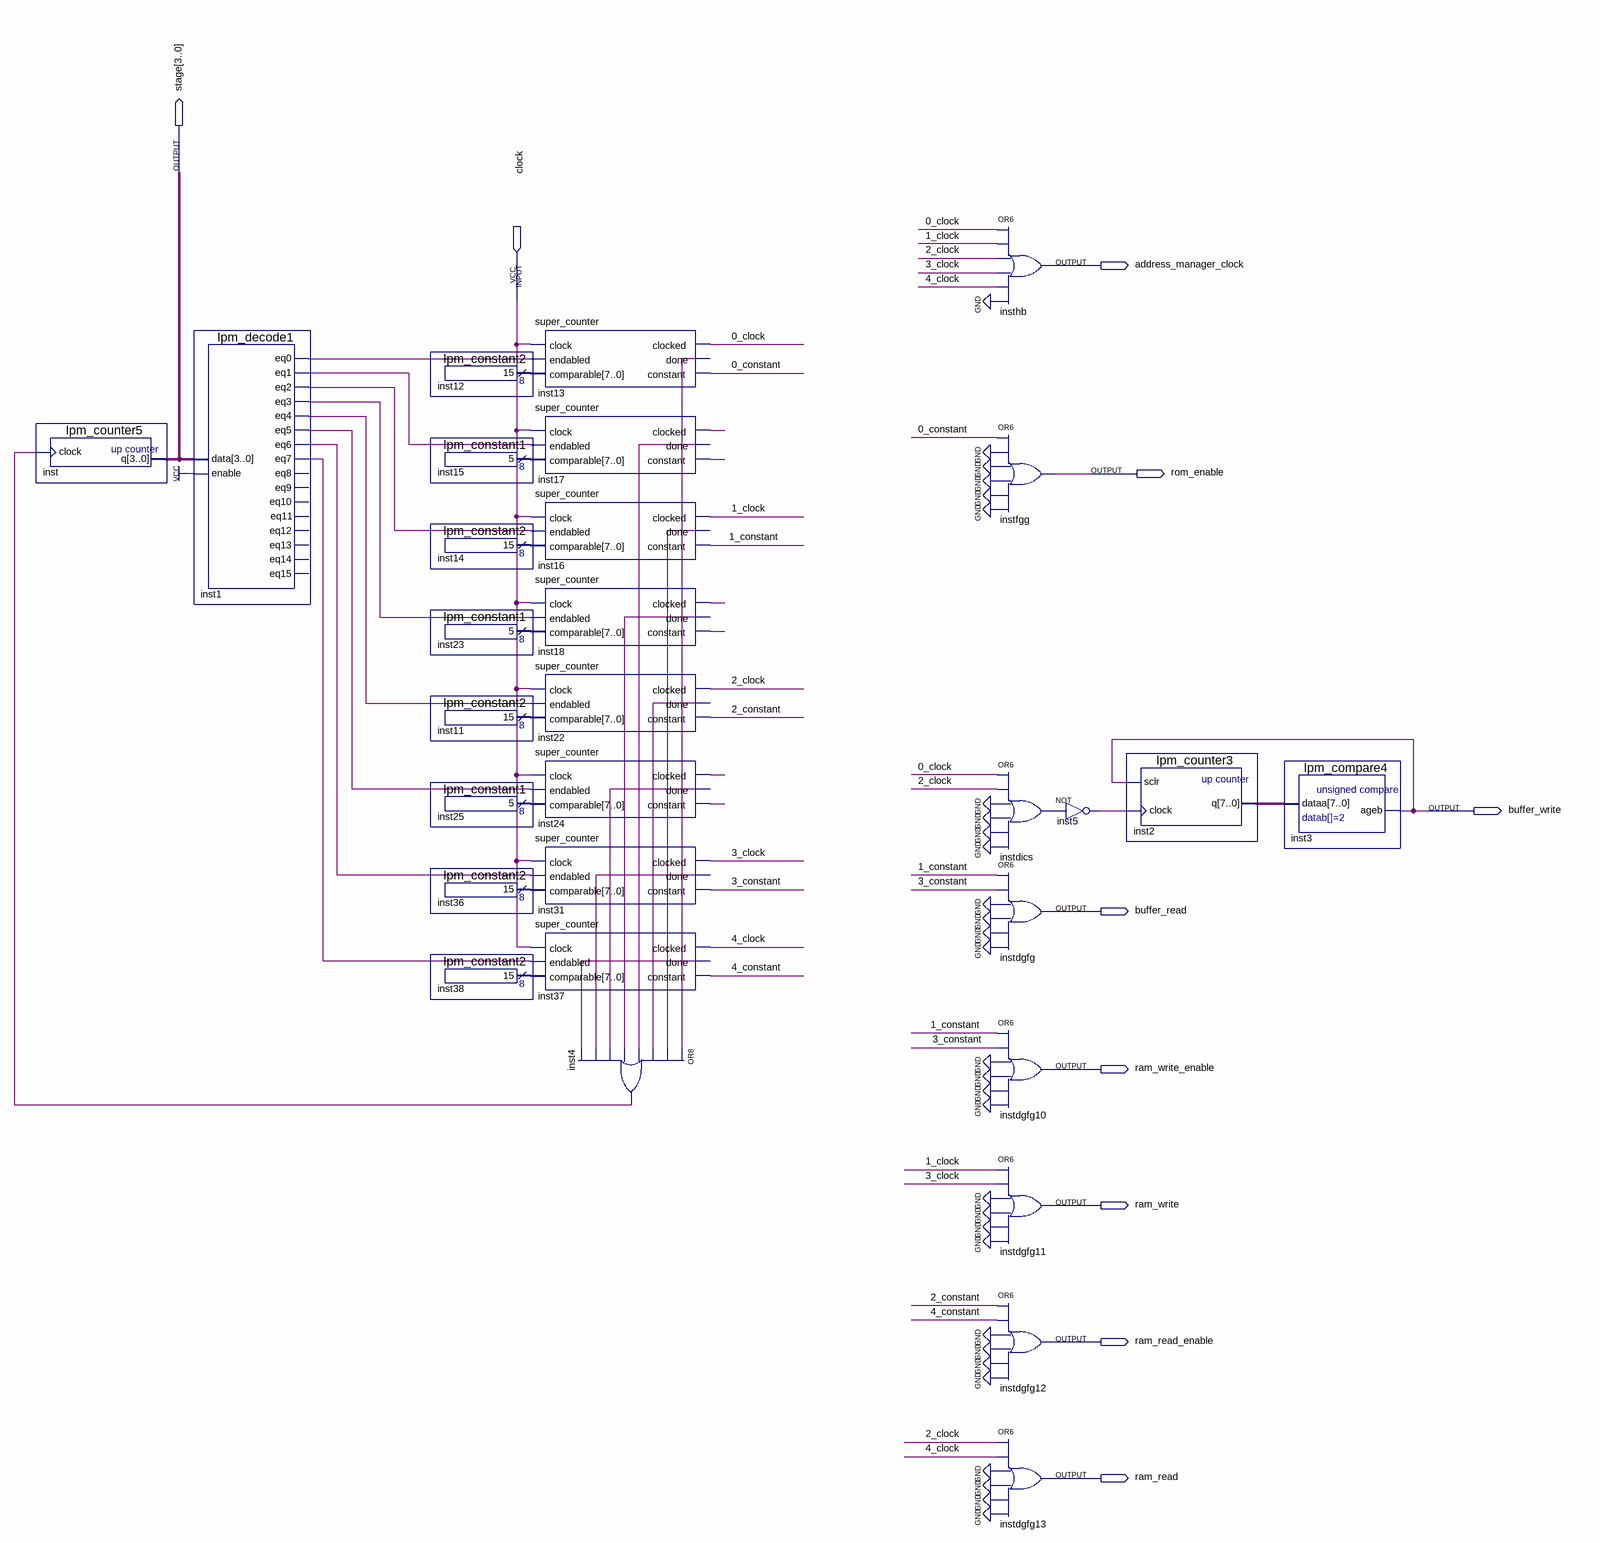
[diagram p0: schematic sheet]
// Quartus schematic Control_Block.bdf as structural Verilog: 30 symbols, 10 pins
module Control_Block (
  input  clock,
  output [3:0] stage,
  output address_manager_clock,
  output rom_enable,
  output buffer_write,
  output buffer_read,
  output ram_write_enable,
  output ram_write,
  output ram_read_enable,
  output ram_read
);

  wire \0_clock , \0_constant , \1_clock , \1_constant , \2_clock , \2_constant , \3_clock , \3_constant ,
       \4_clock , \4_constant , inst1_eq0, inst1_eq1, inst1_eq2, inst1_eq3, inst1_eq4, inst1_eq5, inst1_eq6,
       inst1_eq7, inst4_out, inst5_out, inst13_done, inst16_done, inst17_clocked, inst17_constant,
       inst17_done, inst18_clocked, inst18_constant, inst18_done, inst22_done, inst24_clocked,
       inst24_constant, inst24_done, inst31_done, inst37_done, instdics_out;
  wire [7:0] inst2_q, inst11_result, inst12_result, inst14_result, inst15_result, inst23_result,
       inst25_result, inst36_result, inst38_result;

  lpm_counter5 inst (.clock(inst4_out), .q(stage));
  lpm_decode1 inst1 (
    .data(stage), .enable(1'b1), .eq0(inst1_eq0), .eq1(inst1_eq1), .eq2(inst1_eq2), .eq3(inst1_eq3),
    .eq4(inst1_eq4), .eq5(inst1_eq5), .eq6(inst1_eq6), .eq7(inst1_eq7));  // open: eq8, eq9, eq10, eq11, eq12, eq13, eq14, eq15
  lpm_constant2 inst12 (.result(inst12_result));
  lpm_constant1 inst15 (.result(inst15_result));
  lpm_constant2 inst14 (.result(inst14_result));
  lpm_constant1 inst23 (.result(inst23_result));
  lpm_constant2 inst11 (.result(inst11_result));
  lpm_constant1 inst25 (.result(inst25_result));
  lpm_constant2 inst36 (.result(inst36_result));
  lpm_constant2 inst38 (.result(inst38_result));
  super_counter inst13 (
    .clock(clock), .endabled(inst1_eq0), .comparable(inst12_result), .clocked(\0_clock ), .done(inst13_done),
    .constant(\0_constant ));
  super_counter inst17 (
    .clock(clock), .endabled(inst1_eq1), .comparable(inst15_result), .clocked(inst17_clocked),
    .done(inst17_done), .constant(inst17_constant));
  super_counter inst16 (
    .clock(clock), .endabled(inst1_eq2), .comparable(inst14_result), .clocked(\1_clock ), .done(inst16_done),
    .constant(\1_constant ));
  super_counter inst18 (
    .clock(clock), .endabled(inst1_eq3), .comparable(inst23_result), .clocked(inst18_clocked),
    .done(inst18_done), .constant(inst18_constant));
  super_counter inst22 (
    .clock(clock), .endabled(inst1_eq4), .comparable(inst11_result), .clocked(\2_clock ), .done(inst22_done),
    .constant(\2_constant ));
  super_counter inst24 (
    .clock(clock), .endabled(inst1_eq5), .comparable(inst25_result), .clocked(inst24_clocked),
    .done(inst24_done), .constant(inst24_constant));
  super_counter inst31 (
    .clock(clock), .endabled(inst1_eq6), .comparable(inst36_result), .clocked(\3_clock ), .done(inst31_done),
    .constant(\3_constant ));
  super_counter inst37 (
    .clock(clock), .endabled(inst1_eq7), .comparable(inst38_result), .clocked(\4_clock ), .done(inst37_done),
    .constant(\4_constant ));
  or inst4 (inst4_out, inst13_done, inst16_done, inst22_done, inst17_done, inst18_done, inst24_done, inst31_done, inst37_done);
  or insthb (address_manager_clock, \0_clock , \1_clock , \2_clock , \3_clock , \4_clock , 1'b0);
  or instfgg (rom_enable, \0_constant , 1'b0, 1'b0, 1'b0, 1'b0, 1'b0);
  or instdics (instdics_out, \0_clock , \2_clock , 1'b0, 1'b0, 1'b0, 1'b0);
  or instdgfg (buffer_read, \1_constant , \3_constant , 1'b0, 1'b0, 1'b0, 1'b0);
  or instdgfg10 (ram_write_enable, \1_constant , \3_constant , 1'b0, 1'b0, 1'b0, 1'b0);
  or instdgfg11 (ram_write, \1_clock , \3_clock , 1'b0, 1'b0, 1'b0, 1'b0);
  or instdgfg12 (ram_read_enable, \2_constant , \4_constant , 1'b0, 1'b0, 1'b0, 1'b0);
  or instdgfg13 (ram_read, \2_clock , \4_clock , 1'b0, 1'b0, 1'b0, 1'b0);
  not inst5 (inst5_out, instdics_out);
  lpm_counter3 inst2 (.sclr(buffer_write), .clock(inst5_out), .q(inst2_q));
  lpm_compare4 inst3 (.dataa(inst2_q), .ageb(buffer_write));
endmodule
